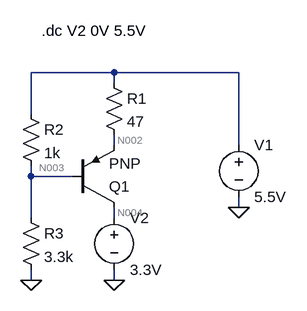
[diagram p0: schematic CurrentSourceTest.asc]
CurrentSourceTest.asc, the LTspice schematic file:
Version 4
SHEET 1 880 680
WIRE 336 160 208 160
WIRE 528 160 336 160
WIRE 336 176 336 160
WIRE 208 224 208 160
WIRE 336 272 336 256
WIRE 528 272 528 160
WIRE 208 320 208 304
WIRE 272 320 208 320
WIRE 528 368 528 352
WIRE 208 384 208 320
WIRE 336 384 336 368
WIRE 208 480 208 464
WIRE 336 480 336 464
FLAG 528 368 0
FLAG 208 480 0
FLAG 336 480 0
SYMBOL pnp 272 368 M180
SYMATTR InstName Q1
SYMBOL res 320 160 R0
SYMATTR InstName R1
SYMATTR Value 47
SYMBOL voltage 528 256 R0
SYMATTR InstName V1
SYMATTR Value 5.5V
SYMBOL res 192 368 R0
SYMATTR InstName R3
SYMATTR Value 3.3k
SYMBOL voltage 336 368 R0
SYMATTR InstName V2
SYMATTR Value 3.3V
SYMBOL res 192 208 R0
SYMATTR InstName R2
SYMATTR Value 1k
TEXT 224 96 Left 2 !.dc V2 0V 5.5V

The netlist it stands for:
* CurrentSourceTest.asc
Q1 N004 N003 N002 0 PNP
R1 N001 N002 47
V1 N001 0 5.5V
R3 N003 0 3.3k
V2 N004 0 3.3V
R2 N001 N003 1k
.model NPN NPN
.model PNP PNP
.lib standard.bjt
.dc V2 0V 5.5V
.backanno
.end

* Results of the author's LTspice run, read from the files saved beside the schematic
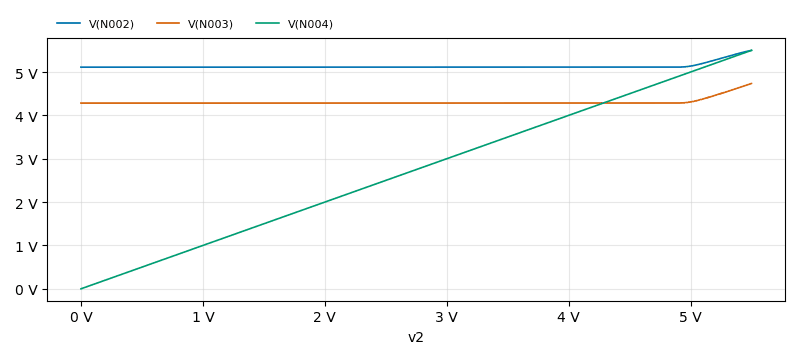
[diagram p1: DC transfer characteristic of CurrentSourceTest.asc, plotted from the saved traces]
* DC transfer characteristic, 1 run:
*   V(N002): 5.112 V at v2=0 V, 5.5 V at v2=5.5 V, min 5.112 V, max 5.5 V
*   V(N003): 4.284 V at v2=0 V, 4.736 V at v2=5.5 V, min 4.284 V, max 4.736 V
*   V(N004): 0 V at v2=0 V, 5.5 V at v2=5.5 V, min 0 V, max 5.5 V